# Altium schematic sheet Portada.SchDoc
size A4; SheetNumber: 1; SheetTotal: 5
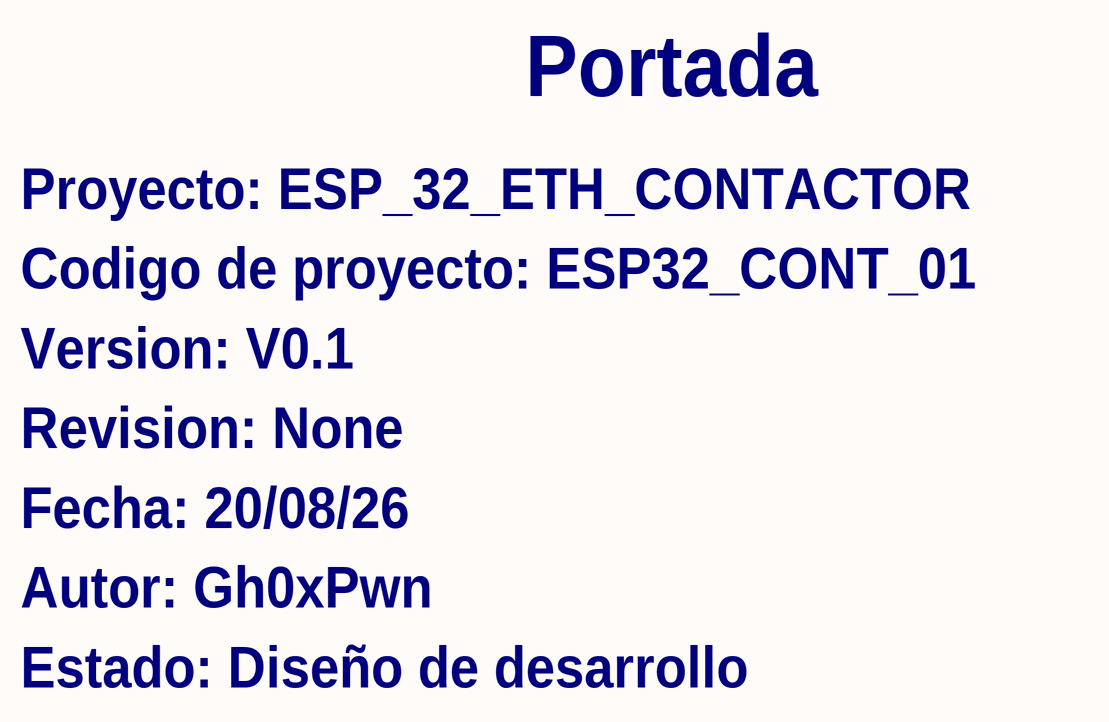
[diagram p0: Portada.SchDoc]

## Notes on the sheet
- Portada
- Proyecto: ESP_32_ETH_CONTACTOR
- Codigo de proyecto: ESP32_CONT_01
- Version: V0.1
- Revision: None
- Fecha: 20/08/26
- Autor: Gh0xPwn
- Estado: Diseño de desarrollo